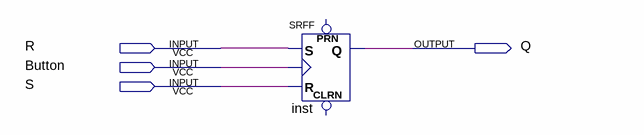
[diagram p0: schematic sheet]
// Quartus schematic lab4_2.bdf as structural Verilog: 1 symbols, 4 pins
module lab4_2 (
  input  R,
  input  Button,
  input  S,
  output Q
);

  SRFF inst (.S(R), .R(S), .CLK(Button), .Q(Q));  // open: PRN, CLRN
endmodule
